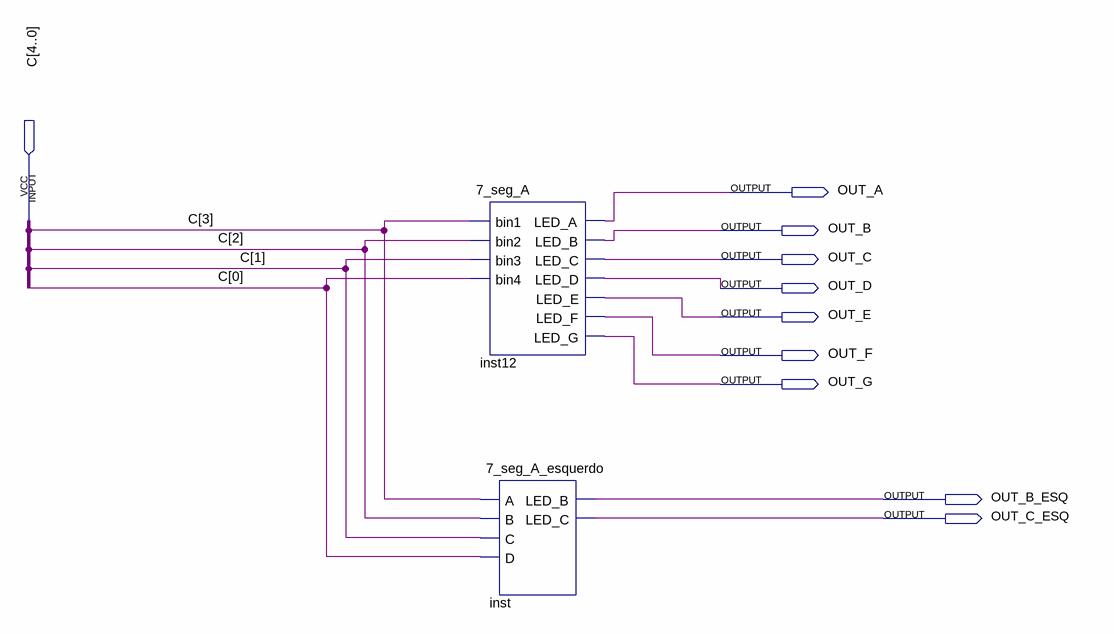
[diagram p0: schematic sheet]
// Quartus schematic ledc.bdf as structural Verilog: 2 symbols, 10 pins
module ledc (
  input  [4:0] C,
  output OUT_A,
  output OUT_B,
  output OUT_C,
  output OUT_D,
  output OUT_E,
  output OUT_F,
  output OUT_G,
  output OUT_B_ESQ,
  output OUT_C_ESQ
);

  \7_seg_A  inst12 (
    .bin1(C[3]), .bin2(C[2]), .bin3(C[1]), .bin4(C[0]), .LED_A(OUT_A), .LED_B(OUT_B), .LED_C(OUT_C),
    .LED_D(OUT_D), .LED_E(OUT_E), .LED_F(OUT_F), .LED_G(OUT_G));
  \7_seg_A_esquerdo  inst (.A(C[3]), .B(C[2]), .C(C[1]), .D(C[0]), .LED_B(OUT_B_ESQ), .LED_C(OUT_C_ESQ));
endmodule
